# Altium schematic sheet Sheet.SchDoc
size A3; SheetNumber: 1; SheetTotal: 1
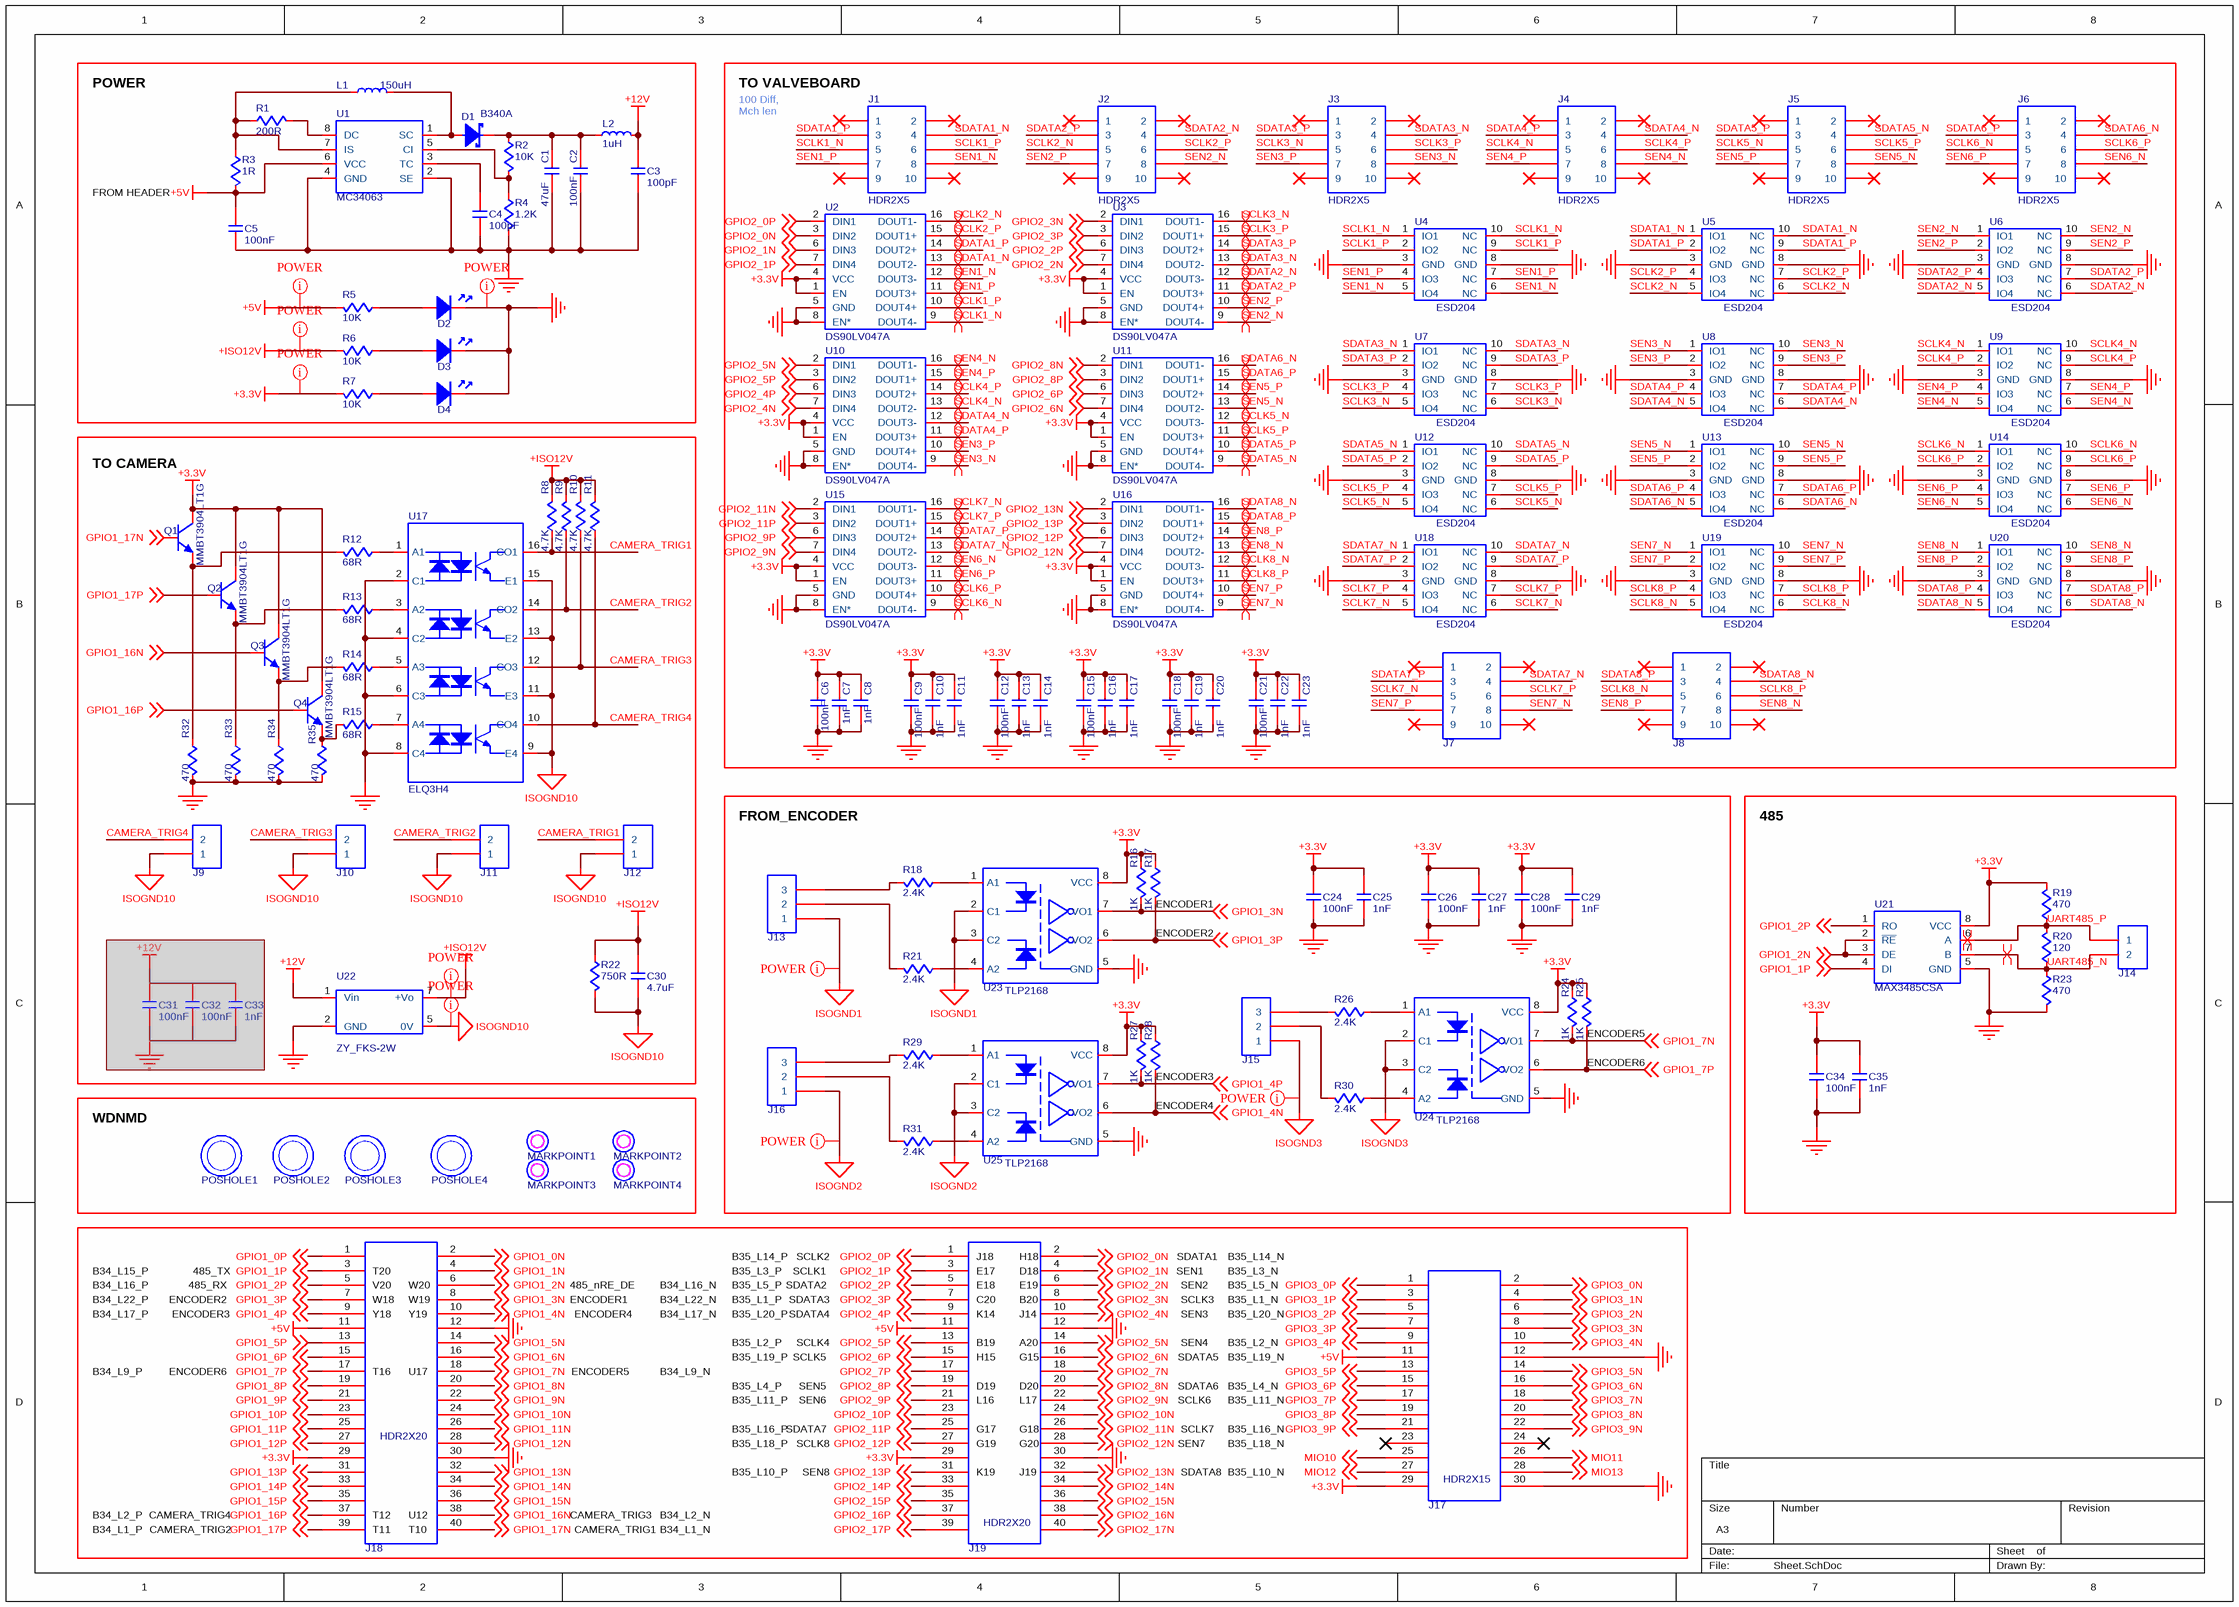
[diagram p0: Sheet.SchDoc]

## Parts
C1  value 47uF  [C0805]  (hidden comment: C-NOMO)
C2  value 100nF  [C0805]  (hidden comment: C-NOMO)
C3  value 100pF  [C0402]  (hidden comment: C-NOMO)
C4  value 100pF  [C0402]  (hidden comment: C-NOMO)
C5  value 100nF  [C0402]  (hidden comment: C-NOMO)
C6  value 100nF  [C0402]  (hidden comment: C-NOMO)
C7  value 1nF  [C0402]  (hidden comment: C-NOMO)
C8  value 1nF  [C0402]  (hidden comment: C-NOMO)
C9  value 100nF  [C0402]  (hidden comment: C-NOMO)
C10  value 1nF  [C0402]  (hidden comment: C-NOMO)
C11  value 1nF  [C0402]  (hidden comment: C-NOMO)
C12  value 100nF  [C0402]  (hidden comment: C-NOMO)
C13  value 1nF  [C0402]  (hidden comment: C-NOMO)
C14  value 1nF  [C0402]  (hidden comment: C-NOMO)
C15  value 100nF  [C0402]  (hidden comment: C-NOMO)
C16  value 1nF  [C0402]  (hidden comment: C-NOMO)
C17  value 1nF  [C0402]  (hidden comment: C-NOMO)
C18  value 100nF  [C0402]  (hidden comment: C-NOMO)
C19  value 1nF  [C0402]  (hidden comment: C-NOMO)
C20  value 1nF  [C0402]  (hidden comment: C-NOMO)
C21  value 100nF  [C0402]  (hidden comment: C-NOMO)
C22  value 1nF  [C0402]  (hidden comment: C-NOMO)
C23  value 1nF  [C0402]  (hidden comment: C-NOMO)
C24  value 100nF  [C0402]  (hidden comment: C-NOMO)
C25  value 1nF  [C0402]  (hidden comment: C-NOMO)
C26  value 100nF  [C0402]  (hidden comment: C-NOMO)
C27  value 1nF  [C0402]  (hidden comment: C-NOMO)
C28  value 100nF  [C0402]  (hidden comment: C-NOMO)
C29  value 1nF  [C0402]  (hidden comment: C-NOMO)
C30  value 4.7uF  [C0805]  (hidden comment: C-NOMO)
C31  value 100nF  [C0402]  (hidden comment: C-NOMO)  (masked out: inside a compile mask, not in the netlist)
C32  value 100nF  [C0402]  (hidden comment: C-NOMO)  (masked out: inside a compile mask, not in the netlist)
C33  value 1nF  [C0402]  (hidden comment: C-NOMO)  (masked out: inside a compile mask, not in the netlist)
C34  value 100nF  [C0402]  (hidden comment: C-NOMO)
C35  value 1nF  [C0402]  (hidden comment: C-NOMO)
D1  B340A  [DO-214AC]
D2  LED  [LED0603]  (value not drawn)
D3  LED  [LED0603]  (value not drawn)
D4  LED  [LED0603]  (value not drawn)
J1  HDR2X5  [HDR2X5-NJ]
J2  HDR2X5  [HDR2X5-NJ]
J3  HDR2X5  [HDR2X5-NJ]
J4  HDR2X5  [HDR2X5-NJ]
J5  HDR2X5  [HDR2X5-NJ]
J6  HDR2X5  [HDR2X5-NJ]
J7  HDR2X5  [HDR2X5-NJ]  (value not drawn)
J8  HDR2X5  [HDR2X5-NJ]  (value not drawn)
J9  HDR1X2  [KF301-5.0-2P]  (value not drawn)
J10  HDR1X2  [KF301-5.0-2P]  (value not drawn)
J11  HDR1X2  [KF301-5.0-2P]  (value not drawn)
J12  HDR1X2  [KF301-5.0-2P]  (value not drawn)
J13  HDR1X3  [KF301-5.0-3P]  (value not drawn)
J14  HDR1X2  [KF301-5.0-2P]  (value not drawn)
J15  HDR1X3  [KF301-5.0-3P]  (value not drawn)
J16  HDR1X3  [KF301-5.0-3P]  (value not drawn)
J17  HDR2X15  [HDR2X15]
J18  HDR2X20  [HDR2X20]
J19  HDR2X20  [HDR2X20]
L1  value 150uH  [FXL1360]  (hidden comment: L)
L2  value 1uH  [FXL0624]  (hidden comment: L)
MARKPOINT1  MARKPOINT  [MARKPOINT-1.0]  (value not drawn)
MARKPOINT2  MARKPOINT  [MARKPOINT-1.0]  (value not drawn)
MARKPOINT3  MARKPOINT  [MARKPOINT-1.0]  (value not drawn)
MARKPOINT4  MARKPOINT  [MARKPOINT-1.0]  (value not drawn)
POSHOLE1  POSHOLE  [POSHOLE-3.2]  (value not drawn)
POSHOLE2  POSHOLE  [POSHOLE-3.2]  (value not drawn)
POSHOLE3  POSHOLE  [POSHOLE-3.2]  (value not drawn)
POSHOLE4  POSHOLE  [POSHOLE-3.2]  (value not drawn)
Q1  MMBT3904LT1G  [SOT-23]
Q2  MMBT3904LT1G  [SOT-23]
Q3  MMBT3904LT1G  [SOT-23]
Q4  MMBT3904LT1G  [SOT-23]
R1  value 200R  [R0402]  (hidden comment: R)
R2  value 10K  [R0402]  (hidden comment: R)
R3  value 1R  [R1812]  (hidden comment: R)
R4  value 1.2K  [R0402]  (hidden comment: R)
R5  value 10K  [R0402]  (hidden comment: R)
R6  value 10K  [R0402]  (hidden comment: R)
R7  value 10K  [R0402]  (hidden comment: R)
R8  value 4.7K  [R0402]  (hidden comment: R)
R9  value 4.7K  [R0402]  (hidden comment: R)
R10  value 4.7K  [R0402]  (hidden comment: R)
R11  value 4.7K  [R0402]  (hidden comment: R)
R12  value 68R  [R0402]  (hidden comment: R)
R13  value 68R  [R0402]  (hidden comment: R)
R14  value 68R  [R0402]  (hidden comment: R)
R15  value 68R  [R0402]  (hidden comment: R)
R16  value 1K  [R0402]  (hidden comment: R)
R17  value 1K  [R0402]  (hidden comment: R)
R18  value 2.4K  [R2512]  (hidden comment: R)
R19  value 470  [R0402]  (hidden comment: R)
R20  value 120  [R0402]  (hidden comment: R)
R21  value 2.4K  [R2512]  (hidden comment: R)
R22  value 750R  [R2512]  (hidden comment: R)
R23  value 470  [R0402]  (hidden comment: R)
R24  value 1K  [R0402]  (hidden comment: R)
R25  value 1K  [R0402]  (hidden comment: R)
R26  value 2.4K  [R2512]  (hidden comment: R)
R27  value 1K  [R0402]  (hidden comment: R)
R28  value 1K  [R0402]  (hidden comment: R)
R29  value 2.4K  [R2512]  (hidden comment: R)
R30  value 2.4K  [R2512]  (hidden comment: R)
R31  value 2.4K  [R2512]  (hidden comment: R)
R32  value 470  [R0402]  (hidden comment: R)
R33  value 470  [R0402]  (hidden comment: R)
R34  value 470  [R0402]  (hidden comment: R)
R35  value 470  [R0402]  (hidden comment: R)
U1  MC34063  [MC34063]
U2  DS90LV047A  [DS90LV047]
U3  DS90LV047A  [DS90LV047]
U4  ESD204  [ESD204]
U5  ESD204  [ESD204]
U6  ESD204  [ESD204]
U7  ESD204  [ESD204]
U8  ESD204  [ESD204]
U9  ESD204  [ESD204]
U10  DS90LV047A  [DS90LV047]
U11  DS90LV047A  [DS90LV047]
U12  ESD204  [ESD204]
U13  ESD204  [ESD204]
U14  ESD204  [ESD204]
U15  DS90LV047A  [DS90LV047]
U16  DS90LV047A  [DS90LV047]
U17  ELQ3H4  [ELQ3H4]
U18  ESD204  [ESD204]
U19  ESD204  [ESD204]
U20  ESD204  [ESD204]
U21  MAX3485CSA  [MAX3485CSA]
U22  ZY_FKS-2W  [ZY_FKS-2W]
U23  TLP2168  [TLP2168]
U24  TLP2168  [TLP2168]
U25  TLP2168  [TLP2168]

## Blocks framed on the sheet
POWER: C1-C5 D1-D4 L1 L2 R1-R7 U1
TO VALVEBOARD: C6-C23 J1-J8 U2-U16 U18-U20
TO CAMERA: C30-C33 J9-J12 Q1-Q4 R8-R15 R22 R32-R35 U17 U22
FROM_ENCODER: C24-C29 J13 J15 J16 R16-R18 R21 R24-R31 U23-U25
485: C34 C35 J14 R19 R20 R23 U21
WDNMD: MARKPOINT1-MARKPOINT4 POSHOLE1-POSHOLE4

## Nets
+3.3V: C6.2 C7.2 C8.2 C9.2 C10.2 C11.2 C12.2 C13.2 C14.2 C15.2 C16.2 C17.2 C18.2 C19.2 C20.2 C21.2 C22.2 C23.2 C24.2 C25.2 C26.2 C27.2 C28.2 C29.2 C34.2 C35.2 J17.29 J18.29 J19.29 Q1.3(C) Q2.3(C) Q3.3(C) Q4.3(C) R7.1 R16.2 R17.2 R19.1 R24.2 R25.2 R27.2 R28.2 U2.1(EN) U2.4(VCC) U3.1(EN) U3.4(VCC) U10.1(EN) U10.4(VCC) U11.1(EN) U11.4(VCC) U15.1(EN) U15.4(VCC) U16.1(EN) U16.4(VCC) U21.8(VCC) U23.8(VCC) U24.8(VCC) U25.8(VCC)
+5V: C5.2 J17.11 J18.11 J19.11 R3.1 R5.1 U1.6(VCC)
+12V: C3.2 L2.2 U22.1(Vin)
+ISO12V: C30.2 R6.1 R8.1 R9.1 R10.1 R11.1 R22.2 U22.7(+Vo)
GND: C1.1 C2.1 C3.1 C4.1 C5.1 C6.1 C7.1 C8.1 C9.1 C10.1 C11.1 C12.1 C13.1 C14.1 C15.1 C16.1 C17.1 C18.1 C19.1 C20.1 C21.1 C22.1 C23.1 C24.1 C25.1 C26.1 C27.1 C28.1 C29.1 C34.1 C35.1 D2.1 D3.1 D4.1 J17.12 J17.30 J18.12 J18.30 J19.12 J19.30 R4.1 R23.1 R32.1 R33.1 R34.1 R35.1 U1.2(SE) U1.4(GND) U2.5(GND) U2.8(EN*) U3.5(GND) U3.8(EN*) U4.3(GND) U4.8(GND) U5.3(GND) U5.8(GND) U6.3(GND) U6.8(GND) U7.3(GND) U7.8(GND) U8.3(GND) U8.8(GND) U9.3(GND) U9.8(GND) U10.5(GND) U10.8(EN*) U11.5(GND) U11.8(EN*) U12.3(GND) U12.8(GND) U13.3(GND) U13.8(GND) U14.3(GND) U14.8(GND) U15.5(GND) U15.8(EN*) U16.5(GND) U16.8(EN*) U17.2(C1) U17.4(C2) U17.6(C3) U17.8(C4) U18.3(GND) U18.8(GND) U19.3(GND) U19.8(GND) U20.3(GND) U20.8(GND) U21.5(GND) U22.2(GND) U23.5(GND) U24.5(GND) U25.5(GND)
ISOGND1: J13.1 U23.2(C1) U23.3(C2)
ISOGND2: J16.1 U25.2(C1) U25.3(C2)
ISOGND3: J15.1 U24.2(C1) U24.3(C2)
ISOGND10: C30.1 J9.1 J10.1 J11.1 J12.1 R22.1 U17.9(E4) U17.11(E3) U17.13(E2) U17.15(E1) U22.5(0V)
CAMERA_TRIG1: J12.2 R8.2 U17.16(CO1)
CAMERA_TRIG2: J11.2 R9.2 U17.14(CO2)
CAMERA_TRIG3: J10.2 R10.2 U17.12(CO3)
CAMERA_TRIG4: J9.2 R11.2 U17.10(CO4)
GPIO1_0N: J18.2 ; off-sheet GPIO1_0N
GPIO1_0P: J18.1 ; off-sheet GPIO1_0P
GPIO1_1N: J18.4 ; off-sheet GPIO1_1N
GPIO1_1P: J18.3 U21.4(DI) ; off-sheet GPIO1_1P
GPIO1_2N: J18.6 U21.2(~{RE}) U21.3(DE) ; off-sheet GPIO1_2N
GPIO1_2P: J18.5 U21.1(RO) ; off-sheet GPIO1_2P
GPIO1_3N: J18.8 R16.1 U23.7(VO1) ; off-sheet GPIO1_3N
GPIO1_3P: J18.7 R17.1 U23.6(VO2) ; off-sheet GPIO1_3P
GPIO1_4N: J18.10 R28.1 U25.6(VO2) ; off-sheet GPIO1_4N
GPIO1_4P: J18.9 R27.1 U25.7(VO1) ; off-sheet GPIO1_4P
GPIO1_5N: J18.14 ; off-sheet GPIO1_5N
GPIO1_5P: J18.13 ; off-sheet GPIO1_5P
GPIO1_6N: J18.16 ; off-sheet GPIO1_6N
GPIO1_6P: J18.15 ; off-sheet GPIO1_6P
GPIO1_7N: J18.18 R24.1 U24.7(VO1) ; off-sheet GPIO1_7N
GPIO1_7P: J18.17 R25.1 U24.6(VO2) ; off-sheet GPIO1_7P
GPIO1_8N: J18.20 ; off-sheet GPIO1_8N
GPIO1_8P: J18.19 ; off-sheet GPIO1_8P
GPIO1_9N: J18.22 ; off-sheet GPIO1_9N
GPIO1_9P: J18.21 ; off-sheet GPIO1_9P
GPIO1_10N: J18.24 ; off-sheet GPIO1_10N
GPIO1_10P: J18.23 ; off-sheet GPIO1_10P
GPIO1_11N: J18.26 ; off-sheet GPIO1_11N
GPIO1_11P: J18.25 ; off-sheet GPIO1_11P
GPIO1_12N: J18.28 ; off-sheet GPIO1_12N
GPIO1_12P: J18.27 ; off-sheet GPIO1_12P
GPIO1_13N: J18.32 ; off-sheet GPIO1_13N
GPIO1_13P: J18.31 ; off-sheet GPIO1_13P
GPIO1_14N: J18.34 ; off-sheet GPIO1_14N
GPIO1_14P: J18.33 ; off-sheet GPIO1_14P
GPIO1_15N: J18.36 ; off-sheet GPIO1_15N
GPIO1_15P: J18.35 ; off-sheet GPIO1_15P
GPIO1_16N: J18.38 Q3.1(B) ; off-sheet GPIO1_16N
GPIO1_16P: J18.37 Q4.1(B) ; off-sheet GPIO1_16P
GPIO1_17N: J18.40 Q1.1(B) ; off-sheet GPIO1_17N
GPIO1_17P: J18.39 Q2.1(B) ; off-sheet GPIO1_17P
GPIO2_0N: J19.2 U2.3(DIN2) ; off-sheet GPIO2_0N
GPIO2_0P: J19.1 U2.2(DIN1) ; off-sheet GPIO2_0P
GPIO2_1N: J19.4 U2.6(DIN3) ; off-sheet GPIO2_1N
GPIO2_1P: J19.3 U2.7(DIN4) ; off-sheet GPIO2_1P
GPIO2_2N: J19.6 U3.7(DIN4) ; off-sheet GPIO2_2N
GPIO2_2P: J19.5 U3.6(DIN3) ; off-sheet GPIO2_2P
GPIO2_3N: J19.8 U3.2(DIN1) ; off-sheet GPIO2_3N
GPIO2_3P: J19.7 U3.3(DIN2) ; off-sheet GPIO2_3P
GPIO2_4N: J19.10 U10.7(DIN4) ; off-sheet GPIO2_4N
GPIO2_4P: J19.9 U10.6(DIN3) ; off-sheet GPIO2_4P
GPIO2_5N: J19.14 U10.2(DIN1) ; off-sheet GPIO2_5N
GPIO2_5P: J19.13 U10.3(DIN2) ; off-sheet GPIO2_5P
GPIO2_6N: J19.16 U11.7(DIN4) ; off-sheet GPIO2_6N
GPIO2_6P: J19.15 U11.6(DIN3) ; off-sheet GPIO2_6P
GPIO2_7N: J19.18 ; off-sheet GPIO2_7N
GPIO2_7P: J19.17 ; off-sheet GPIO2_7P
GPIO2_8N: J19.20 U11.2(DIN1) ; off-sheet GPIO2_8N
GPIO2_8P: J19.19 U11.3(DIN2) ; off-sheet GPIO2_8P
GPIO2_9N: J19.22 U15.7(DIN4) ; off-sheet GPIO2_9N
GPIO2_9P: J19.21 U15.6(DIN3) ; off-sheet GPIO2_9P
GPIO2_10N: J19.24 ; off-sheet GPIO2_10N
GPIO2_10P: J19.23 ; off-sheet GPIO2_10P
GPIO2_11N: J19.26 U15.2(DIN1) ; off-sheet GPIO2_11N
GPIO2_11P: J19.25 U15.3(DIN2) ; off-sheet GPIO2_11P
GPIO2_12N: J19.28 U16.7(DIN4) ; off-sheet GPIO2_12N
GPIO2_12P: J19.27 U16.6(DIN3) ; off-sheet GPIO2_12P
GPIO2_13N: J19.32 U16.2(DIN1) ; off-sheet GPIO2_13N
GPIO2_13P: J19.31 U16.3(DIN2) ; off-sheet GPIO2_13P
GPIO2_14N: J19.34 ; off-sheet GPIO2_14N
GPIO2_14P: J19.33 ; off-sheet GPIO2_14P
GPIO2_15N: J19.36 ; off-sheet GPIO2_15N
GPIO2_15P: J19.35 ; off-sheet GPIO2_15P
GPIO2_16N: J19.38 ; off-sheet GPIO2_16N
GPIO2_16P: J19.37 ; off-sheet GPIO2_16P
GPIO2_17N: J19.40 ; off-sheet GPIO2_17N
GPIO2_17P: J19.39 ; off-sheet GPIO2_17P
GPIO3_0N: J17.2 ; off-sheet GPIO3_0N
GPIO3_0P: J17.1 ; off-sheet GPIO3_0P
GPIO3_1N: J17.4 ; off-sheet GPIO3_1N
GPIO3_1P: J17.3 ; off-sheet GPIO3_1P
GPIO3_2N: J17.6 ; off-sheet GPIO3_2N
GPIO3_2P: J17.5 ; off-sheet GPIO3_2P
GPIO3_3N: J17.8 ; off-sheet GPIO3_3N
GPIO3_3P: J17.7 ; off-sheet GPIO3_3P
GPIO3_4N: J17.10 ; off-sheet GPIO3_4N
GPIO3_4P: J17.9 ; off-sheet GPIO3_4P
GPIO3_5N: J17.14 ; off-sheet GPIO3_5N
GPIO3_5P: J17.13 ; off-sheet GPIO3_5P
GPIO3_6N: J17.16 ; off-sheet GPIO3_6N
GPIO3_6P: J17.15 ; off-sheet GPIO3_6P
GPIO3_7N: J17.18 ; off-sheet GPIO3_7N
GPIO3_7P: J17.17 ; off-sheet GPIO3_7P
GPIO3_8N: J17.20 ; off-sheet GPIO3_8N
GPIO3_8P: J17.19 ; off-sheet GPIO3_8P
GPIO3_9N: J17.22 ; off-sheet GPIO3_9N
GPIO3_9P: J17.21 ; off-sheet GPIO3_9P
MIO10: J17.25 ; off-sheet MIO10
MIO11: J17.26 ; off-sheet MIO11
MIO12: J17.27 ; off-sheet MIO12
MIO13: J17.28 ; off-sheet MIO13
SCLK1_N: J1.5 U2.9(DOUT4-) U4.1(IO1) U4.10(NC)
SCLK1_P: J1.6 U2.10(DOUT4+) U4.2(IO2) U4.9(NC)
SCLK2_N: J2.5 U2.16(DOUT1-) U5.5(IO4) U5.6(NC)
SCLK2_P: J2.6 U2.15(DOUT1+) U5.4(IO3) U5.7(NC)
SCLK3_N: J3.5 U3.16(DOUT1-) U7.5(IO4) U7.6(NC)
SCLK3_P: J3.6 U3.15(DOUT1+) U7.4(IO3) U7.7(NC)
SCLK4_N: J4.5 U9.1(IO1) U9.10(NC) U10.13(DOUT2-)
SCLK4_P: J4.6 U9.2(IO2) U9.9(NC) U10.14(DOUT2+)
SCLK5_N: J5.5 U11.12(DOUT3-) U12.5(IO4) U12.6(NC)
SCLK5_P: J5.6 U11.11(DOUT3+) U12.4(IO3) U12.7(NC)
SCLK6_N: J6.5 U14.1(IO1) U14.10(NC) U15.9(DOUT4-)
SCLK6_P: J6.6 U14.2(IO2) U14.9(NC) U15.10(DOUT4+)
SCLK7_N: J7.5 U15.16(DOUT1-) U18.5(IO4) U18.6(NC)
SCLK7_P: J7.6 U15.15(DOUT1+) U18.4(IO3) U18.7(NC)
SCLK8_N: J8.5 U16.12(DOUT3-) U19.5(IO4) U19.6(NC)
SCLK8_P: J8.6 U16.11(DOUT3+) U19.4(IO3) U19.7(NC)
SDATA1_N: J1.4 U2.13(DOUT2-) U5.1(IO1) U5.10(NC)
SDATA1_P: J1.3 U2.14(DOUT2+) U5.2(IO2) U5.9(NC)
SDATA2_N: J2.4 U3.12(DOUT3-) U6.5(IO4) U6.6(NC)
SDATA2_P: J2.3 U3.11(DOUT3+) U6.4(IO3) U6.7(NC)
SDATA3_N: J3.4 U3.13(DOUT2-) U7.1(IO1) U7.10(NC)
SDATA3_P: J3.3 U3.14(DOUT2+) U7.2(IO2) U7.9(NC)
SDATA4_N: J4.4 U8.5(IO4) U8.6(NC) U10.12(DOUT3-)
SDATA4_P: J4.3 U8.4(IO3) U8.7(NC) U10.11(DOUT3+)
SDATA5_N: J5.4 U11.9(DOUT4-) U12.1(IO1) U12.10(NC)
SDATA5_P: J5.3 U11.10(DOUT4+) U12.2(IO2) U12.9(NC)
SDATA6_N: J6.4 U11.16(DOUT1-) U13.5(IO4) U13.6(NC)
SDATA6_P: J6.3 U11.15(DOUT1+) U13.4(IO3) U13.7(NC)
SDATA7_N: J7.4 U15.13(DOUT2-) U18.1(IO1) U18.10(NC)
SDATA7_P: J7.3 U15.14(DOUT2+) U18.2(IO2) U18.9(NC)
SDATA8_N: J8.4 U16.16(DOUT1-) U20.5(IO4) U20.6(NC)
SDATA8_P: J8.3 U16.15(DOUT1+) U20.4(IO3) U20.7(NC)
SEN1_N: J1.8 U2.12(DOUT3-) U4.5(IO4) U4.6(NC)
SEN1_P: J1.7 U2.11(DOUT3+) U4.4(IO3) U4.7(NC)
SEN2_N: J2.8 U3.9(DOUT4-) U6.1(IO1) U6.10(NC)
SEN2_P: J2.7 U3.10(DOUT4+) U6.2(IO2) U6.9(NC)
SEN3_N: J3.8 U8.1(IO1) U8.10(NC) U10.9(DOUT4-)
SEN3_P: J3.7 U8.2(IO2) U8.9(NC) U10.10(DOUT4+)
SEN4_N: J4.8 U9.5(IO4) U9.6(NC) U10.16(DOUT1-)
SEN4_P: J4.7 U9.4(IO3) U9.7(NC) U10.15(DOUT1+)
SEN5_N: J5.8 U11.13(DOUT2-) U13.1(IO1) U13.10(NC)
SEN5_P: J5.7 U11.14(DOUT2+) U13.2(IO2) U13.9(NC)
SEN6_N: J6.8 U14.5(IO4) U14.6(NC) U15.12(DOUT3-)
SEN6_P: J6.7 U14.4(IO3) U14.7(NC) U15.11(DOUT3+)
SEN7_N: J7.8 U16.9(DOUT4-) U19.1(IO1) U19.10(NC)
SEN7_P: J7.7 U16.10(DOUT4+) U19.2(IO2) U19.9(NC)
SEN8_N: J8.8 U16.13(DOUT2-) U20.1(IO1) U20.10(NC)
SEN8_P: J8.7 U16.14(DOUT2+) U20.2(IO2) U20.9(NC)
UART485_N: J14.2 R20.2 R23.2 U21.7(B)
UART485_P: J14.1 R19.2 R20.1 U21.6(A)
NetC1_2: C1.2 C2.2 D1.1 L2.1 R2.2
NetC4_2: C4.2 U1.3(TC)
NetD1_2: D1.2 L1.2 U1.1(SC)
NetD2_2: D2.2 R5.2
NetD3_2: D3.2 R6.2
NetD4_2: D4.2 R7.2
NetJ13_2: J13.2 R21.1
NetJ13_3: J13.3 R18.1
NetJ15_2: J15.2 R30.1
NetJ15_3: J15.3 R26.1
NetJ16_2: J16.2 R31.1
NetJ16_3: J16.3 R29.1
NetL1_1: L1.1 R1.2 R3.2 U1.7(IS)
NetQ1_2: Q1.2(E) R12.1 R32.2
NetQ2_2: Q2.2(E) R13.1 R33.2
NetQ3_2: Q3.2(E) R14.1 R34.2
NetQ4_2: Q4.2(E) R15.1 R35.2
NetR1_1: R1.1 U1.8(DC)
NetR2_1: R2.1 R4.2 U1.5(CI)
NetR12_2: R12.2 U17.1(A1)
NetR13_2: R13.2 U17.3(A2)
NetR14_2: R14.2 U17.5(A3)
NetR15_2: R15.2 U17.7(A4)
NetR18_2: R18.2 U23.1(A1)
NetR21_2: R21.2 U23.4(A2)
NetR26_2: R26.2 U24.1(A1)
NetR29_2: R29.2 U25.1(A1)
NetR30_2: R30.2 U24.4(A2)
NetR31_2: R31.2 U25.4(A2)

Not connected (* = marked no-connect by the designer): J1 1* 2* 9* 10*; J2 1* 2* 9* 10*; J3 1* 2* 9* 10*; J4 1* 2* 9* 10*; J5 1* 2* 9* 10*; J6 1* 2* 9* 10*; J7 1* 2* 9* 10*; J8 1* 2* 9* 10*; J17 23* 24*

## Layout directives
differential pair; differential pair class VALVEBOARD2: SCLK2_N, SCLK2_P, SDATA2_N, SDATA2_P, SEN2_N, SEN2_P
differential pair; differential pair class VALVEBOARD1: SCLK1_N, SCLK1_P, SDATA1_N, SDATA1_P, SEN1_N, SEN1_P
differential pair; differential pair class VALVEBOARD3: SCLK3_N, SCLK3_P, SDATA3_N, SDATA3_P, SEN3_N, SEN3_P
differential pair; differential pair class UART485: UART485_N, UART485_P
net class POWER: +3.3V, +5V, +ISO12V, GND, ISOGND1, ISOGND2, ISOGND3, ISOGND10
differential pair; differential pair class VALVEBOARD4: SCLK4_N, SCLK4_P, SDATA4_N, SDATA4_P, SEN4_N, SEN4_P
differential pair; differential pair class VALVEBOARD6: SCLK6_N, SCLK6_P, SDATA6_N, SDATA6_P, SEN6_N, SEN6_P
differential pair; differential pair class VALVEBOARD5: SCLK5_N, SCLK5_P, SDATA5_N, SDATA5_P, SEN5_N, SEN5_P
differential pair; differential pair class VALVEBOARD7: SCLK7_N, SCLK7_P, SDATA7_N, SDATA7_P, SEN7_N, SEN7_P
differential pair; differential pair class VALVEBOARD8: SCLK8_N, SCLK8_P, SDATA8_N, SDATA8_P, SEN8_N, SEN8_P

## Notes on the sheet
- 100 Diff, Mch len
- FROM HEADER
- (near R17) ENCODER1
- ENCODER2
- (near R25) ENCODER5
- ENCODER4
- (near R28) ENCODER3
- ENCODER6
- B34_L15_P
- 485_TX
- (near J18) T20
- B35_L14_P
- B35_L3_P
- SCLK2
- SCLK1
- (near J19) J18
- (near J19) E17
- (near J19) H18
- (near J19) D18
- SEN1
- SDATA1
- B35_L14_N
- B35_L3_N
- B34_L16_P
- B34_L22_P
- B34_L17_P
- ENCODER3
- 485_RX
- (near J18) V20
- (near J18) W18
- (near J18) Y18
- (near J18) Y19
- (near J18) W19
- (near J18) W20
- ENCODER1
- 485_nRE_DE
- B34_L16_N
- B34_L22_N
- B34_L17_N
- B35_L5_P
- B35_L1_P
- B35_L20_P
- B35_L2_P
- SDATA3
- SDATA4
- SCLK4
- SDATA2
- (near J19) E18
- (near J19) C20
- (near J19) K14
- (near J19) B19
- (near J19) E19
- (near J19) B20
- (near J19) J14
- (near J19) A20
- SCLK3
- SEN4
- SEN2
- SEN3
- B35_L5_N
- B35_L1_N
- B35_L20_N
- B35_L2_N
- B34_L9_P
- (near J18) T16
- (near J18) U17
- ENCODER5
- B34_L9_N
- B35_L19_P
- B35_L4_P
- B35_L11_P
- SEN6
- SEN5
- SCLK5
- (near J19) H15
- (near J19) D19
- (near J19) L16
- (near J19) G15
- (near J19) D20
- (near J19) L17
- SCLK6
- SDATA6
- SDATA5
- B35_L19_N
- B35_L4_N
- B35_L11_N
- B35_L16_P
- B35_L18_P
- B35_L10_P
- SCLK8
- SEN8
- SDATA7
- (near J19) G17
- (near J19) G19
- (near J19) K19
- (near J19) G18
- (near J19) G20
- (near J19) J19
- SCLK7
- SDATA8
- SEN7
- B35_L16_N
- B35_L18_N
- B35_L10_N
- B34_L2_P
- B34_L1_P
- CAMERA_TRIG4
- CAMERA_TRIG2
- (near J18) T12
- (near J18) T11
- (near J18) U12
- (near J18) T10
- CAMERA_TRIG1
- CAMERA_TRIG3
- B34_L2_N
- B34_L1_N

## Library data of the parts
C1-C35 = C-NOMO: voltage: 25V; precision: 5%
D1 = DIOD3: HelpURL: ./referencce/bzt52c13.pdf#page=(1)
L1 L2 = L: Code_IEC: 1005; Published: 8-Jun-2000; LatestRevisionDate: 29-May-2009; LatestRevisionNote: IPC-7351 Footprint Added.; PackageReference: 0402-A; Publisher: Altium Limited; PackageDescription: Chip Inductor; Code_JEITA: 0402
Q1-Q4 = NPN: Supplier 1: LCSC; Supplier Part Number 1: C260863
R1-R35 = R: precision: 1%
J1-J8 = HDR2X5: Supplier 1: LCSC; Supplier Part Number 1: C225520; Supplier 2: LCSC; Supplier Part Number 2: C5665
J9-J12 J14 = HDR1X2: Supplier 1: LCSC; Supplier Part Number 1: C474881; Supplier 2: LCSC; Supplier Part Number 2: C225477; Supplier 3: LCSC; Supplier Part Number 3: C20079
J13 J15 J16 = HDR1X3: Supplier 1: LCSC; Supplier Part Number 1: C474884; Supplier 2: LCSC; Supplier Part Number 2: C609572
J17 = HDR2X15: Supplier 1: LCSC; Supplier Part Number 1: C124359; Supplier 2: LCSC; Supplier Part Number 2: C3405
J18 J19 = HDR2X20: Supplier 1: LCSC; Supplier Part Number 1: C124383
U1 = MC34063: Supplier 1: LCSC; Supplier Part Number 1: C408271
U2 U3 U10 U11 U15 U16 = DS90LV047A: Supplier Part Number 1: C87097; Supplier 1: LCSC
U4-U9 U12-U14 U18-U20 = ESD204: Supplier 1: LCSC; Supplier Part Number 1: C553132
U17 = ELQ3H4: Supplier 1: LCSC; Supplier Part Number 1: C150957
U21 = MAX3485CSA: Supplier 1: LCSC; Supplier Part Number 1: C1121852